# Altium project TPA2.PrjPcb
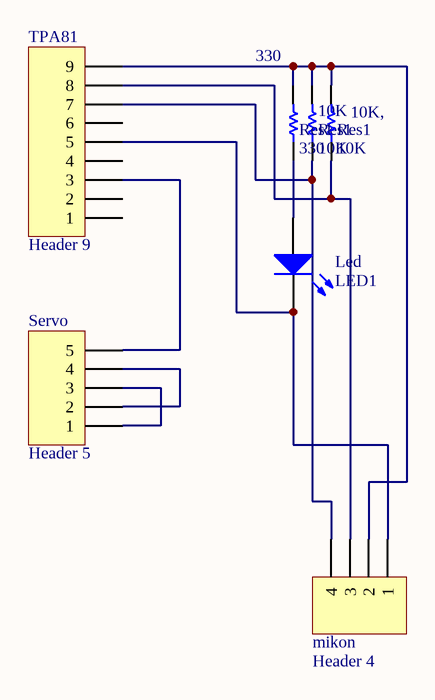
[diagram p0: TPA2.SchDoc]
1 sheet, 7 parts. Net scope: global (net labels, ports and power ports of the same name join across sheets).
Board file: TPA2.PcbDoc

## Sheet TPA2.SchDoc
size A4

### Parts
10K  Res1  value 10K  [AXIAL-0.3]
10K,  Res1  value 10K  [AXIAL-0.3]
330  Res1  value 330  [AXIAL-0.3]
Led  LED1  [LED-1]
mikon  Header 4  [HDR1X4]
Servo  Header 5  [HDR1X5]
TPA81  Header 9  [HDR1X9]

### Nets
Net10K,_1: 10K,.1 mikon.3 TPA81.8
Net10K_1: 10K.1 mikon.4 TPA81.7
Net10K_2: 10K.2 10K,.2 330.2 mikon.2 TPA81.9
Net330_1: 330.1 Led.1(A)
NetLed_2: Led.2(K) mikon.1 TPA81.5
NetServo_1: Servo.1 Servo.3
NetServo_2: Servo.2 Servo.4
NetServo_5: Servo.5 TPA81.3

Not connected (* = marked no-connect by the designer): TPA81 1 2 4 6

### Library data of the parts
10K 10K, 330 = Res1: Resistor; Published: 8-Jun-2000; LatestRevisionDate: 17-Jul-2002; LatestRevisionNote: Re-released for DXP Platform.; PackageReference: AXIAL-0.3; Publisher: Altium Limited
Led = LED1: Typical RED GaAs LED; Published: 8-Jun-2000; LatestRevisionDate: 08-Jul-2005; LatestRevisionNote: Mech Layer 1 removed.; PackageReference: LED-1; Publisher: Altium Limited
mikon = Header 4: Header, 4-Pin; LatestRevisionDate: 17-Jul-2002; LatestRevisionNote: Re-released for DXP Platform.; Publisher: Altium Limited
Servo = Header 5: Header, 5-Pin; LatestRevisionDate: 17-Jul-2002; LatestRevisionNote: Re-released for DXP Platform.; Publisher: Altium Limited
TPA81 = Header 9: Header, 9-Pin; LatestRevisionDate: 17-Jul-2002; LatestRevisionNote: Re-released for DXP Platform.; Publisher: Altium Limited